# EAGLE schematic polarity_pcb_schematic (EAGLE 9.7.0)
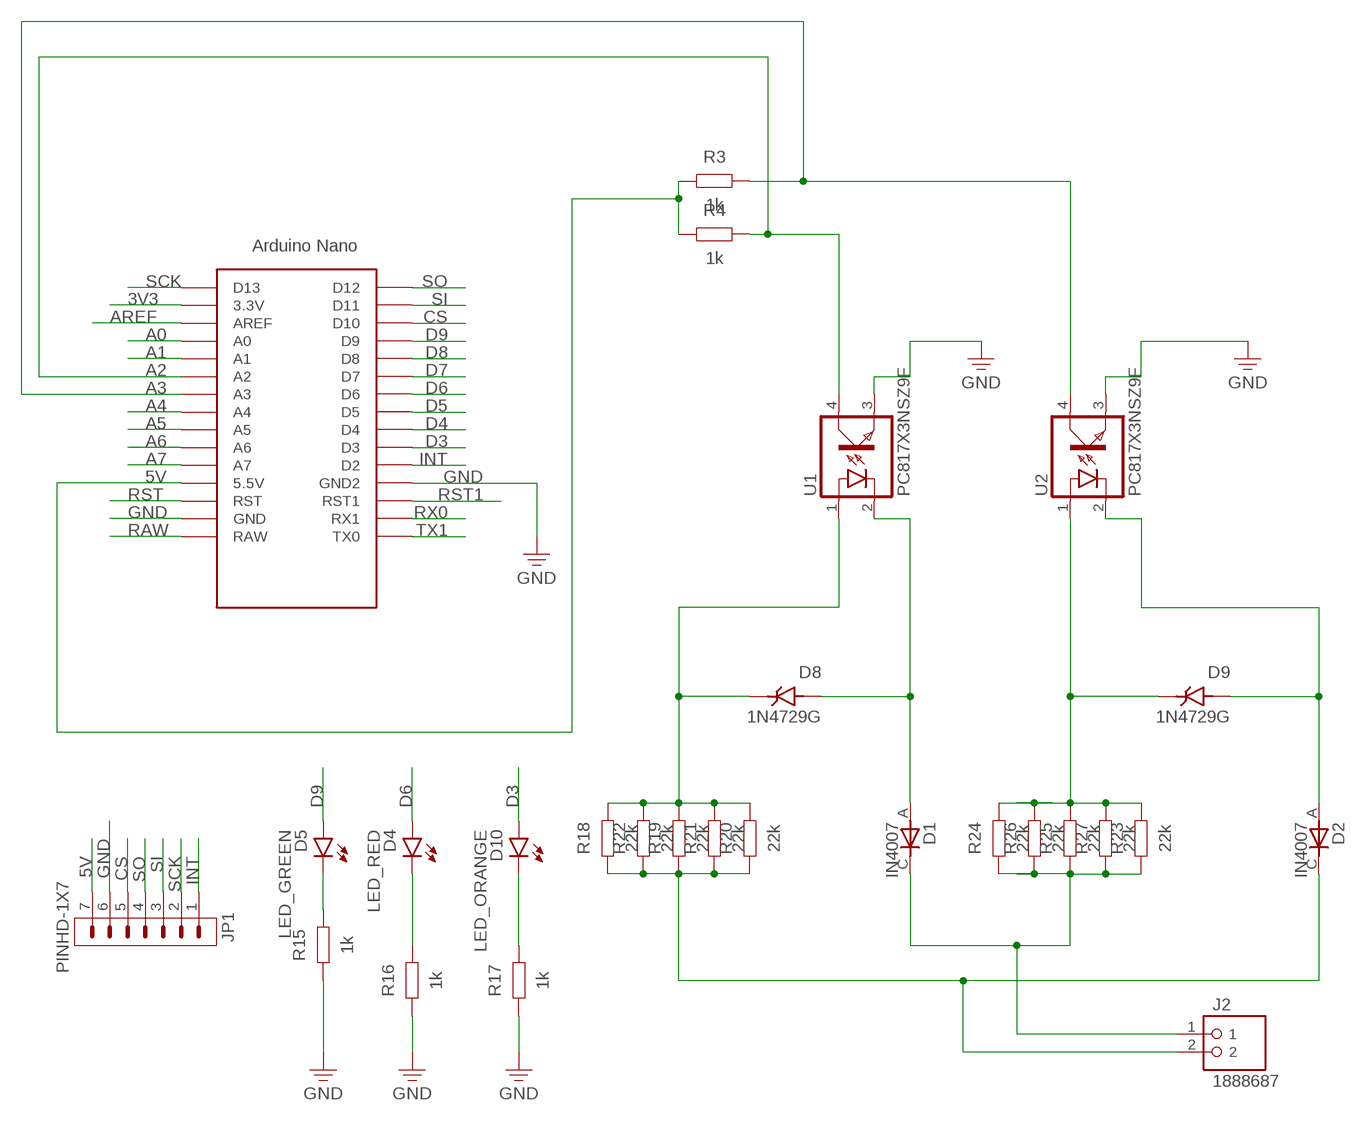
[diagram p0: schematic, sheet 1]

## Parts
D1  IN4007  [DIOAD1070W78L470D235P]
D2  IN4007  [DIOAD1070W78L470D235P]
D4  LED_RED  LED_RADIAL_RED  [LEDRD254W60D565H860B]
D5  LED_GREEN  LED_RADIAL_GREEN  [LEDRD254W60D565H860B_G]
D8  1N4729G  [DIOAD1036W73L450D282]
D9  1N4729G  [DIOAD1036W73L450D282]
D10  LED_ORANGE  LED_RADIAL_ORANGE  [LEDRD254W60D565H860B_O]
J2  1888687  [PHOENIX_1888687]
JP1  PINHD-1X7  [1X07]
R3  1k  R_AXIAL-11.7MM-PITCH  [RESAD1176W63L850D250B]
R4  1k  R_AXIAL-11.7MM-PITCH  [RESAD1176W63L850D250B]
R15  1k  R_AXIAL-11.7MM-PITCH  [RESAD1176W63L850D250B]
R16  1k  R_AXIAL-11.7MM-PITCH  [RESAD1176W63L850D250B]
R17  1k  R_AXIAL-11.7MM-PITCH  [RESAD1176W63L850D250B]
R18  22k  R_AXIAL-11.7MM-PITCH  [RESAD1176W63L850D250B]
R19  22k  R_AXIAL-11.7MM-PITCH  [RESAD1176W63L850D250B]
R20  22k  R_AXIAL-11.7MM-PITCH  [RESAD1176W63L850D250B]
R21  22k  R_AXIAL-11.7MM-PITCH  [RESAD1176W63L850D250B]
R22  22k  R_AXIAL-11.7MM-PITCH  [RESAD1176W63L850D250B]
R23  22k  R_AXIAL-11.7MM-PITCH  [RESAD1176W63L850D250B]
R24  22k  R_AXIAL-11.7MM-PITCH  [RESAD1176W63L850D250B]
R25  22k  R_AXIAL-11.7MM-PITCH  [RESAD1176W63L850D250B]
R26  22k  R_AXIAL-11.7MM-PITCH  [RESAD1176W63L850D250B]
R27  22k  R_AXIAL-11.7MM-PITCH  [RESAD1176W63L850D250B]
U1  PC817X3NSZ9F  [DIL04]
U2  PC817X3NSZ9F  [DIL04]
U$1  NANO  [NANO]

## Nets
3V3: U$1.3.3V
5V: JP1.7 R3.1 R4.1 U$1.5V(5.5V)
A0: U$1.A0
A1: U$1.A1
A2: R4.2 U1.4(COL) U$1.A2
A3: R3.2 U2.4(COL) U$1.A3
A4: U$1.A4
A5: U$1.A5
A6: U$1.A6
A7: U$1.A7
AREF: U$1.AREF
CS: JP1.5 U$1.D10
D3: D10.1(A) U$1.D3
D4: U$1.D4
D5: U$1.D5
D6: D4.1(A) U$1.D6
D7: U$1.D7
D8: U$1.D8
D9: D5.1(A) U$1.D9
GND: JP1.6 R15.1 R16.1 R17.1 U1.3(EMIT) U2.3(EMIT) U$1.GND U$1.GND1(GND2)
INT: JP1.1 U$1.D2
N$1: D8.C(K) R18.2 R19.2 R20.2 R21.2 R22.2 U1.1(A)
N$2: D1.A D8.A U1.2(C)
N$4: D1.C J2.1 R23.1 R24.1 R25.1 R26.1 R27.1
N$6: D5.2(C) R15.2
N$7: D9.C(K) R23.2 R24.2 R25.2 R26.2 R27.2 U2.1(A)
N$8: D2.A D9.A U2.2(C)
N$12: D4.2(C) R16.2
N$14: D10.2(C) R17.2
N$25: D2.C J2.2 R18.1 R19.1 R20.1 R21.1 R22.1
RAW: U$1.RAW
RST: U$1.RST
RST1: U$1.RST1
RX0: U$1.RX1
SCK: JP1.2 U$1.D13
SI: JP1.3 U$1.D11
SO: JP1.4 U$1.D12
TX1: U$1.TX0
Unconnected: U$1.ICSP1 U$1.ICSP2 U$1.ICSP3 U$1.ICSP4 U$1.ICSP5 U$1.ICSP6

## Library data of the parts
D1 D2 = IN4007:IN4007: Check availability <https://pricing.snapeda.com/parts/IN4007/Vishay%20Semiconductor/view-part?ref=eda>; AVAILABILITY: Not in stock; CHECK_PRICES: https://www.snapeda.com/parts/IN4007/Vishay/view-part/?ref=eda; DESCRIPTION: Diode Standard 1000 V 1A Through Hole DO-204AL (DO-41); MF: Vishay Semiconductor; MP: IN4007; PACKAGE: DO-41 Vishay Semiconductor; PRICE: None; SNAPEDA_LINK: https://www.snapeda.com/parts/IN4007/Vishay/view-part/?ref=snap
D4 D5 D10 = Tinkercad:LED_RADIAL: LED - Generic; CATEGORY: Opto-Electronic; SUB-CATEGORY: LED
D8 D9 = 1N4729G:1N4729G: Check availability <https://pricing.snapeda.com/parts/1N4729G/Taiwan%20Semiconductor/view-part?ref=eda>; AVAILABILITY: In Stock; CHECK_PRICES: https://www.snapeda.com/parts/1N4729G/taiwan/view-part/?ref=eda; DESCRIPTION: Zener Diode 3.6 V 1 W ±5% Through Hole DO-204AL (DO-41); MF: Taiwan Semiconductor; MP: 1N4729G; PACKAGE: DO-41-2 Taiwan Semiconductor; PRICE: None; SNAPEDA_LINK: https://www.snapeda.com/parts/1N4729G/taiwan/view-part/?ref=snap
J2 = 1888687:1888687: Check availability <https://pricing.snapeda.com/parts/1888687/Phoenix%20Contact/view-part?ref=eda>; AVAILABILITY: In Stock; CHECK_PRICES: https://www.snapeda.com/parts/1888687/Phoenix+Contact/view-part/?ref=eda; DESCRIPTION: PCB Terminal Screw 5.08mm 12AWG 400V 24A 2 Position COMBICON MKDSN Series | Phoenix Contact 1888687; MF: Phoenix Contact; MP: 1888687; PACKAGE: None; PRICE: None; SNAPEDA_LINK: https://www.snapeda.com/parts/1888687/Phoenix+Contact/view-part/?ref=snap
JP1 = Connector:PINHD-1X7: Pin Header; CATEGORY: Connectors; DESCRIPTION: Header-Straight-7 Position; PACKAGE_TYPE: Through Hole; PITCH: 0.100" (2.54mm); SUBCATEGORY: Headers; TYPE: Male Pins
R3 R4 R15-R27 = Resistor:R: Resistor Fixed - Generic; CATEGORY: Resistors; DESCRIPTION: Axial Resistor 11.76 mm pitch 8.5 mm body length 2.5 mm body diameter; PACKAGE_SIZE: Axial; PACKAGE_TYPE: Through Hole
U1 U2 = optopc817:PC817X3NSZ9F: Check availability <https://pricing.snapeda.com/parts/PC817X3NSZ9F/Sharp%20Microelectronics/view-part?ref=eda>; AVAILABILITY: In Stock; CHECK_PRICES: https://www.snapeda.com/parts/PC817X3NSZ9F/Sharp/view-part/?ref=eda; DESCRIPTION: Optoisolator Transistor Output 5000Vrms 1 Channel 4-DIP; MF: Sharp Microelectronics; MP: PC817X3NSZ9F; PACKAGE: DIP-4 Sharp Microelectronics; PRICE: None; SNAPEDA_LINK: https://www.snapeda.com/parts/PC817X3NSZ9F/Sharp/view-part/?ref=snap
U$1 = Arduino-clone:NANO: Arduino Nano